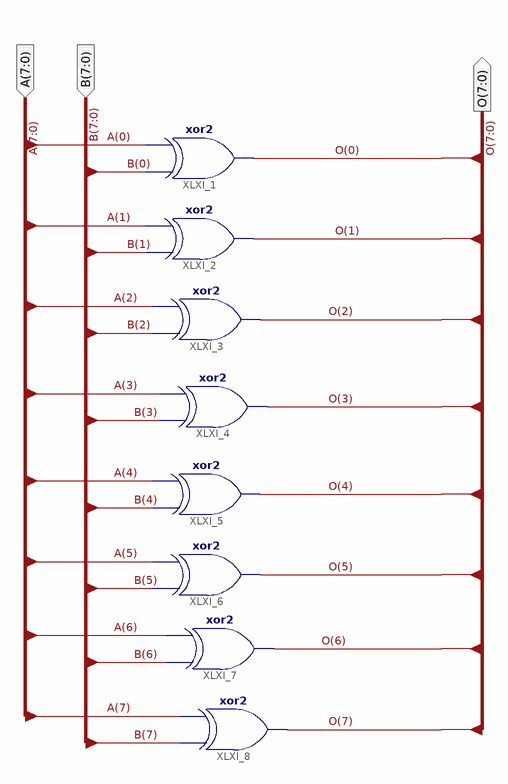
[diagram p0: schematic sheet 1]
// Xilinx ISE schematic KRxor8.sch (spartan6) as structural Verilog: 8 symbols, 3 ports
module KRxor8 (
  input  [7:0] A,
  input  [7:0] B,
  output [7:0] O
);

  xor XLXI_1 (O[0], B[0], A[0]);
  xor XLXI_2 (O[1], B[1], A[1]);
  xor XLXI_3 (O[2], B[2], A[2]);
  xor XLXI_4 (O[3], B[3], A[3]);
  xor XLXI_5 (O[4], B[4], A[4]);
  xor XLXI_6 (O[5], B[5], A[5]);
  xor XLXI_7 (O[6], B[6], A[6]);
  xor XLXI_8 (O[7], B[7], A[7]);
endmodule
